# EAGLE schematic midiphile (EAGLE 7.6.0)
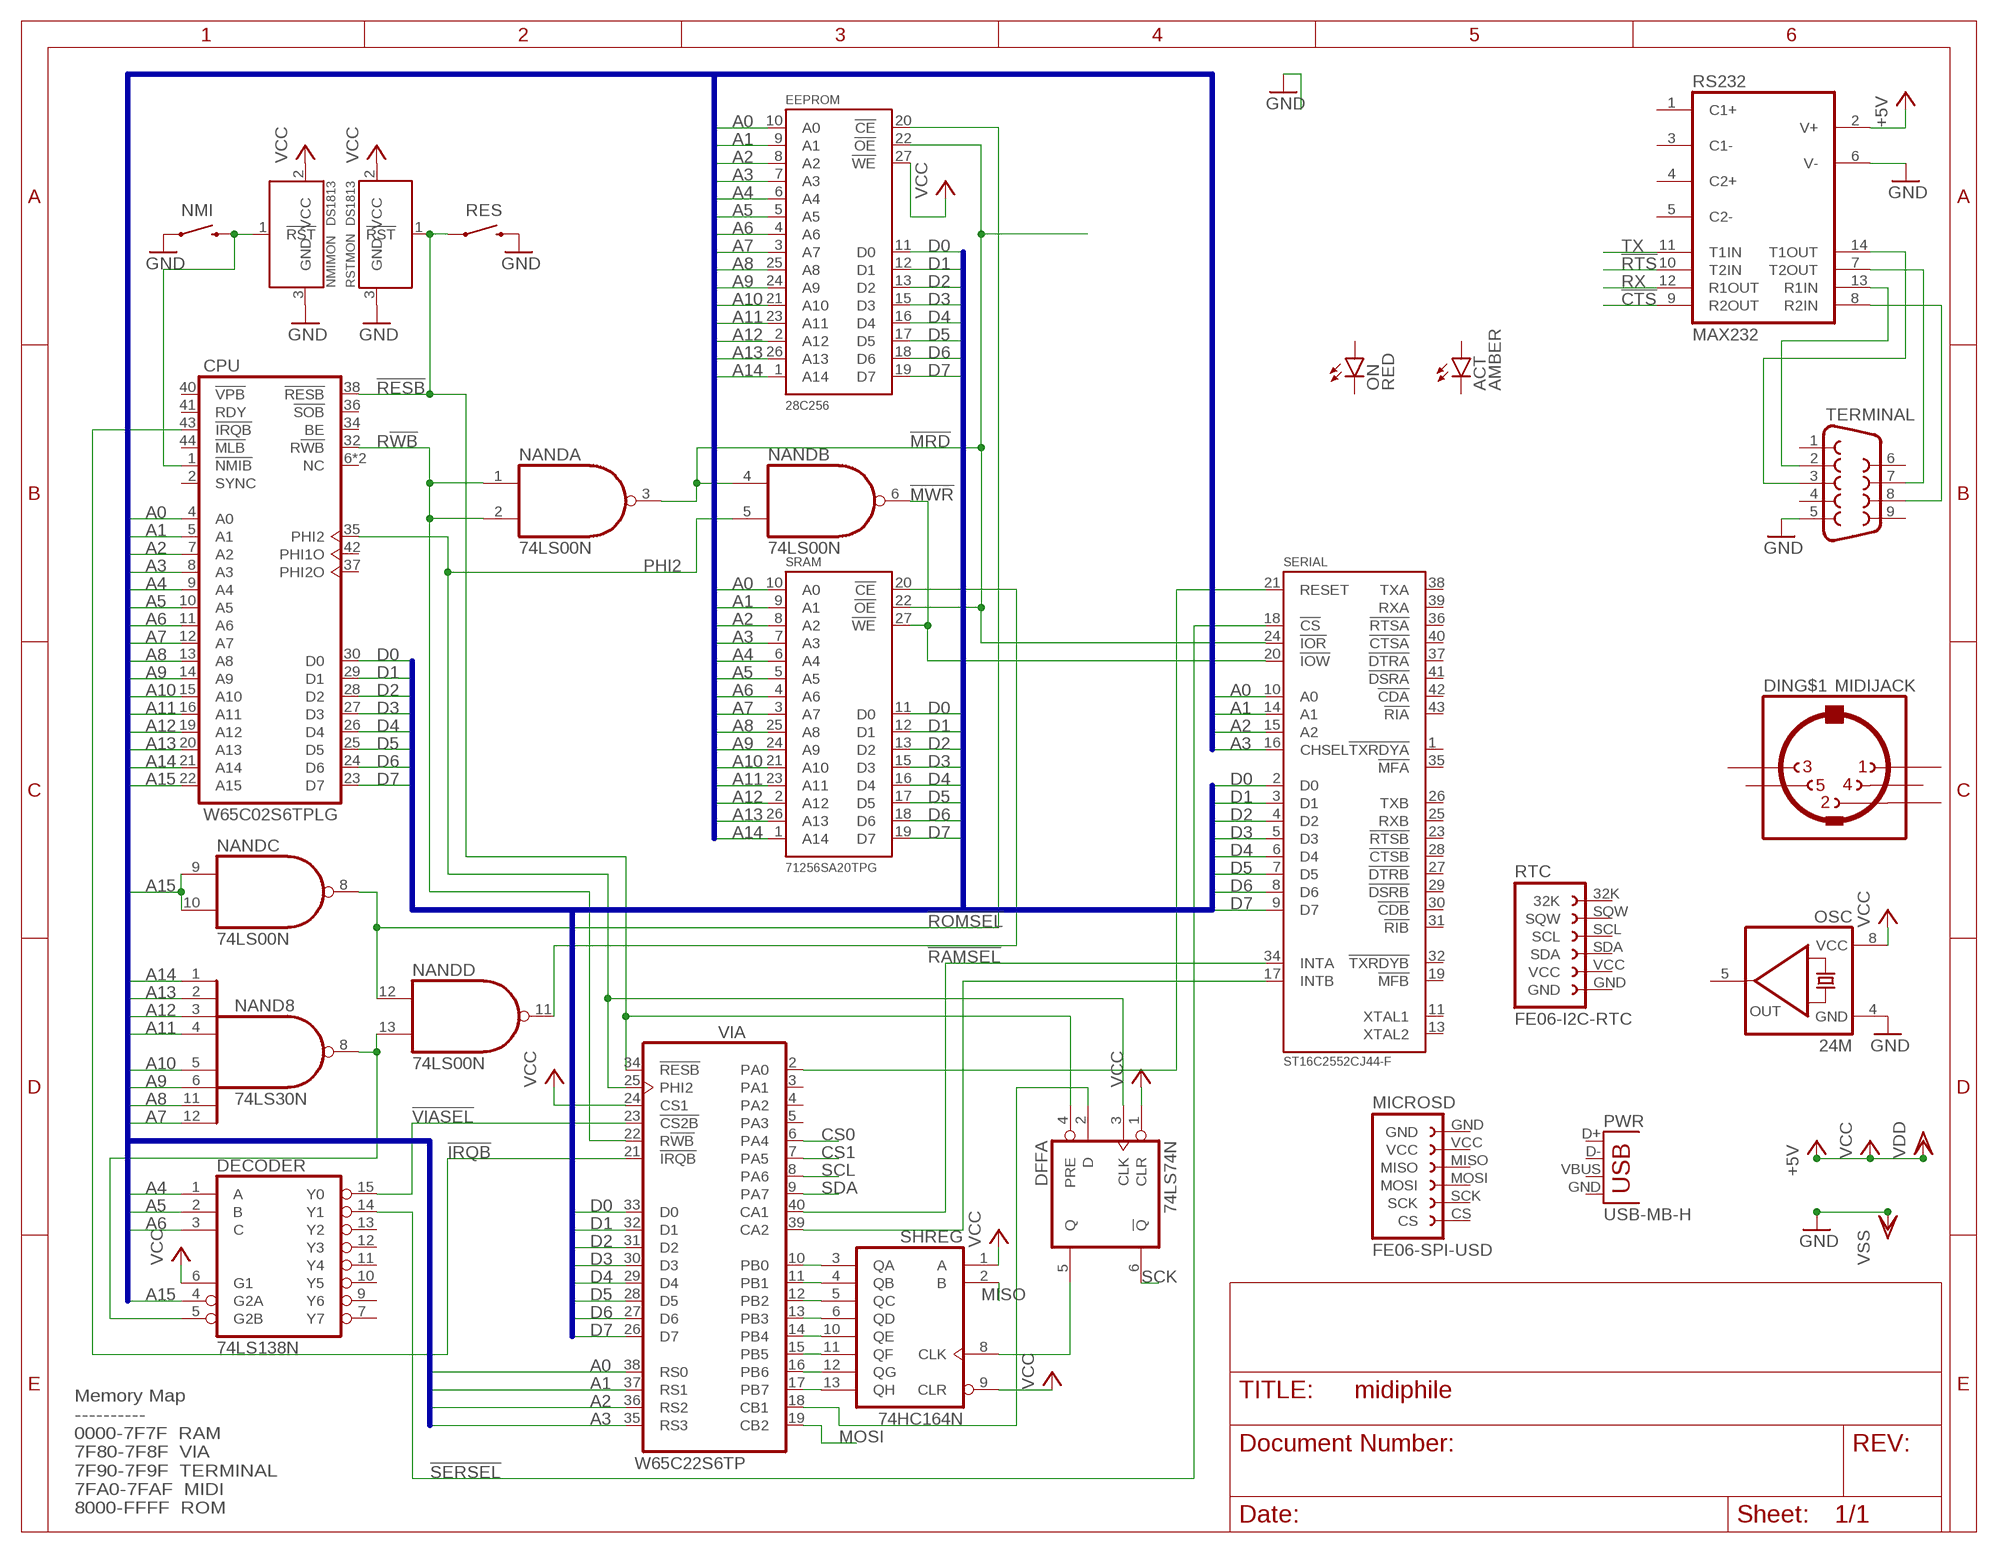
[diagram p0: schematic, sheet 1]

## Parts
ACT  AMBER  LED_RECT_2X5MM  [LED_RECT_2X5MM]
CPU  W65C02S6TPLG  [S44]
DECODER  74LS138N  [DIL16]
DFF  74LS74N  [DIL14]
DIN  MIDIJACK  [CP-2350]
EEPROM  28C256  [DIL28]
MICROSD  FE06-SPI-USD  [FE06-SPI-USD]
NAND  74LS00N  [DIL14]
NAND8  74LS30N  [DIL14]
NMI  SWITCH-MOMENTARY-2PTH  [TACTILE-PTH]
NMIMON  DS1813  [TO-92]
ON  RED  LED_RECT_2X5MM  [LED_RECT_2X5MM]
OSC  24M  HALF_CAN_OSC  [HALF_CAN_SOCKET]
PWR  USB-MB-H  [USB-MB-H]
RES  SWITCH-MOMENTARY-2PTH  [TACTILE-PTH]
RS232  MAX232  [DIL16]
RSTMON  DS1813  [TO-92]
RTC  FE06-I2C-RTC  [FE06-I2C-RTC]
SERIAL  ST16C2552CJ44-F  [S44]
SHREG  74HC164N  [DIL14]
SRAM  71256SA20TPG  [DIL28-3]
TERMINAL  DB9MALE  [DB9_MALE]
VIA  W65C22S6TP  [DIL40]

## Nets
!CTS!: RS232.9(R2OUT)
!IRQB!: CPU.43(!IRQB) VIA.21(VIA:!IRQB)
!MRD!: EEPROM.22(!OE!) NAND.3(A:O) NAND.4(B:I0) SERIAL.24(!IOR!) SRAM.22(!OE!)
!MWR!: NAND.6(B:O) SERIAL.20(!IOW!) SRAM.27(!WE!)
!RAMSEL!: NAND.11(D:O) SRAM.20(!CE!)
!RESB!: CPU.38(!RESB) DFF.4(A:PRE) RES.1 RSTMON.1(!RST!) VIA.34(VIA:!RESB)
!ROMSEL!: EEPROM.20(!CE!) NAND.8(C:O) NAND.12(D:I0)
!RTS!: RS232.10(T2IN)
!SERSEL!: DECODER.14(Y1) SERIAL.18(!CS!)
!VIASEL!: DECODER.15(Y0) VIA.23(VIA:!CS2B)
+5V: RS232.2(V+) ; supply symbol labelled VCC, VDD
A0: CPU.4(A0) EEPROM.10(A0) SERIAL.10(A0) SRAM.10(A0) VIA.38(VIA:RS0)
A1: CPU.5(A1) EEPROM.9(A1) SERIAL.14(A1) SRAM.9(A1) VIA.37(VIA:RS1)
A2: CPU.7(A2) EEPROM.8(A2) SERIAL.15(A2) SRAM.8(A2) VIA.36(VIA:RS2)
A3: CPU.8(A3) EEPROM.7(A3) SERIAL.16(CHSEL) SRAM.7(A3) VIA.35(VIA:RS3)
A4: CPU.9(A4) DECODER.1(A) EEPROM.6(A4) SRAM.6(A4)
A5: CPU.10(A5) DECODER.2(B) EEPROM.5(A5) SRAM.5(A5)
A6: CPU.11(A6) DECODER.3(C) EEPROM.4(A6) SRAM.4(A6)
A7: CPU.12(A7) EEPROM.3(A7) NAND8.12(I7) SRAM.3(A7)
A8: CPU.13(A8) EEPROM.25(A8) NAND8.11(I6) SRAM.25(A8)
A9: CPU.14(A9) EEPROM.24(A9) NAND8.6(I5) SRAM.24(A9)
A10: CPU.15(A10) EEPROM.21(A10) NAND8.5(I4) SRAM.21(A10)
A11: CPU.16(A11) EEPROM.23(A11) NAND8.4(I3) SRAM.23(A11)
A12: CPU.19(A12) EEPROM.2(A12) NAND8.3(I2) SRAM.2(A12)
A13: CPU.20(A13) EEPROM.26(A13) NAND8.2(I1) SRAM.26(A13)
A14: CPU.21(A14) EEPROM.1(A14) NAND8.1(I0) SRAM.1(A14)
A15: CPU.22(A15) DECODER.4(G2A) NAND.9(C:I0) NAND.10(C:I1)
CS0: VIA.6(VIA:PA4)
CS1: VIA.7(VIA:PA5)
D0: CPU.30(D0) EEPROM.11(D0) SERIAL.2(D0) SRAM.11(D0) VIA.33(VIA:D0)
D1: CPU.29(D1) EEPROM.12(D1) SERIAL.3(D1) SRAM.12(D1) VIA.32(VIA:D1)
D2: CPU.28(D2) EEPROM.13(D2) SERIAL.4(D2) SRAM.13(D2) VIA.31(VIA:D2)
D3: CPU.27(D3) EEPROM.15(D3) SERIAL.5(D3) SRAM.15(D3) VIA.30(VIA:D3)
D4: CPU.26(D4) EEPROM.16(D4) SERIAL.6(D4) SRAM.16(D4) VIA.29(VIA:D4)
D5: CPU.25(D5) EEPROM.17(D5) SERIAL.7(D5) SRAM.17(D5) VIA.28(VIA:D5)
D6: CPU.24(D6) EEPROM.18(D6) SERIAL.8(D6) SRAM.18(D6) VIA.27(VIA:D6)
D7: CPU.23(D7) EEPROM.19(D7) SERIAL.9(D7) SRAM.19(D7) VIA.26(VIA:D7)
GND: NMI.1 NMIMON.3(GND) OSC.4(GND) RES.3 RS232.6(V-) RSTMON.3(GND) TERMINAL.5 ; supply symbol labelled VSS
MISO: SHREG.2(B)
MOSI: VIA.19(VIA:CB2)
N$1: CPU.1(!NMIB) NMI.3 NMIMON.1(!RST!)
N$2: DECODER.5(G2B) NAND8.8(O) NAND.13(D:I1)
N$3: SERIAL.17(INTB) VIA.39(VIA:CA2)
N$4: SERIAL.34(INTA) VIA.40(VIA:CA1)
N$5: SERIAL.21(RESET) VIA.2(VIA:PA0)
N$7: SHREG.3(QA) VIA.10(VIA:PB0)
N$8: SHREG.4(QB) VIA.11(VIA:PB1)
N$9: SHREG.5(QC) VIA.12(VIA:PB2)
N$10: SHREG.6(QD) VIA.13(VIA:PB3)
N$11: SHREG.10(QE) VIA.14(VIA:PB4)
N$12: SHREG.11(QF) VIA.15(VIA:PB5)
N$13: SHREG.12(QG) VIA.16(VIA:PB6)
N$14: SHREG.13(QH) VIA.17(VIA:PB7)
N$15: DFF.2(A:D) VIA.18(VIA:CB1)
N$17: DFF.5(A:Q) SHREG.8(CLK)
N$21: RS232.14(T1OUT) TERMINAL.3
N$22: RS232.13(R1IN) TERMINAL.2
N$23: RS232.7(T2OUT) TERMINAL.7
N$24: RS232.8(R2IN) TERMINAL.8
PHI2: CPU.35(PHI2) DFF.3(A:CLK) NAND.5(B:I1) VIA.25(VIA:PHI2)
R!WB!: CPU.32(R!WB) NAND.1(A:I0) NAND.2(A:I1) VIA.22(VIA:R!WB)
RX: RS232.12(R1OUT)
SCK: DFF.6(A:!Q)
SCL: VIA.8(VIA:PA6)
SDA: VIA.9(VIA:PA7)
TX: RS232.11(T1IN)
VCC: DECODER.6(G1) DFF.1(A:CLR) EEPROM.27(!WE!) NMIMON.2(VCC) OSC.8(VCC) RSTMON.2(VCC) SHREG.1(A) SHREG.9(CLR) VIA.24(VIA:CS1)
Unconnected: ACT.+(A) ACT.-(C) CPU.2(SYNC) CPU.6(NC) CPU.33(NC) CPU.34(BE) CPU.36(!SOB) CPU.37(PHI2O) CPU.40(!VPB) CPU.41(RDY) CPU.42(PHI1O) CPU.44(!MLB) DECODER.7(Y7) DECODER.9(Y6) DECODER.10(Y5) DECODER.11(Y4) DECODER.12(Y3) DECODER.13(Y2) DFF.8(B:!Q) DFF.9(B:Q) DFF.10(B:PRE) DFF.11(B:CLK) DFF.12(B:D) DFF.13(B:CLR) DIN.1 DIN.2 DIN.3 DIN.4 DIN.5 DIN.PE1(MT) DIN.PE2(MT) DIN.PE(MT) DIN.PE@(MT) MICROSD.CS MICROSD.GND MICROSD.MISO MICROSD.MOSI MICROSD.SCK MICROSD.VCC ON.+(A) ON.-(C) OSC.5(OUT) PWR.D+ PWR.D- PWR.GND PWR.VBUS RS232.1(C1+) RS232.3(C1-) RS232.4(C2+) RS232.5(C2-) RTC.32K RTC.GND RTC.SCL RTC.SDA RTC.SQW RTC.VCC SERIAL.1(!TXRDYA!) SERIAL.11(XTAL1) SERIAL.13(XTAL2) SERIAL.19(!MFB!) SERIAL.23(!RTSB!) SERIAL.25(RXB) SERIAL.26(TXB) SERIAL.27(!DTRB!) SERIAL.28(!CTSB!) SERIAL.29(!DSRB!) SERIAL.30(!CDB!) SERIAL.31(!RIB!) SERIAL.32(!TXRDYB!) SERIAL.35(!MFA!) SERIAL.36(!RTSA!) SERIAL.37(!DTRA!) SERIAL.38(TXA) SERIAL.39(RXA) SERIAL.40(!CTSA!) SERIAL.41(!DSRA!) SERIAL.42(!CDA!) SERIAL.43(!RIA!) TERMINAL.1 TERMINAL.4 TERMINAL.6 TERMINAL.9 VIA.3(VIA:PA1) VIA.4(VIA:PA2) VIA.5(VIA:PA3)

## Buses
A[0..15]
D[0..7]

## Notes on the sheet
- Memory Map
  ----------
  0000-7F7F  RAM
  7F80-7F8F  VIA
  7F90-7F9F  TERMINAL
  7FA0-7FAF  MIDI
  8000-FFFF  ROM

## Power pins joined to a net without a drawn wire
+5V: CPU.3(VDD) CPU.31(VDD) DECODER.16(VCC) NAND.14(P:VCC) SERIAL.33(VDD) SERIAL.44(VDD) SHREG.14(VCC) SRAM.28(VDD)
GND: CPU.17(VSS) CPU.18(VSS) CPU.39(VSS) DECODER.8(GND) DFF.7(P:GND) NAND8.7(GND) NAND.7(P:GND) RS232.15(GND) SERIAL.12(VSS) SERIAL.22(VSS) SHREG.7(GND) SRAM.14(VSS)
VCC: DFF.14(P:VCC) NAND8.14(VCC) RS232.16(VCC)
VDD: EEPROM.28(VDD) VIA.20(VIAP:VDD)
VSS: EEPROM.14(VSS) VIA.1(VIAP:VSS)

## Library data of the parts
ACT ON = led:LED_RECT_2X5MM
CPU = 6502:W65C02S6TPLG
DECODER = 74xx-us:74*138: 3-line to 8-line DECODER/DEMULTIPLEXER
DFF = 74xx-us:74*74: Dual D type positive edge triggered FLIP FLOP, preset and clear
DIN = adafruit:MIDIJACK: DIN 5 jack also known as MIDI jack A modification of conn-hirshman:MAB5SH with two options for the grounding 'teeth'
EEPROM = 28Cxxx_eeprom:28C256
MICROSD = expansion_headers:FE06-SPI-USD
NAND = 74xx-us:74*00: Quad 2-input NAND gate
NAND8 = 74xx-us:74*30: 8-input NAND gate
NMI RES = SparkFun-Electromechanical:SWITCH-MOMENTARY-2: Various NO switches- pushbuttons, reed, etc; PROD_ID: SWCH-08441
NMIMON RSTMON = ds1813:DS1813
OSC = metal_can_oscillator:HALF_CAN_OSC
PWR = SparkFun-Connectors:USB: USB Connectors USB-B-PTH is fully proven SKU : PRT-00139/CONN-08278 USB-miniB is fully proven SKU : PRT-00587 USB-A-PCB is untested. USB-A-H is throughly reviewed, but untested. Spark Fun Electronics SKU : PRT-00437 USB-B-SMT is throughly reviewed, but untested. Needs silkscreen touching up. USB-A-S has not been used/tested USB-MB-H has not been used/tested USB-MICROB has been used. CONN-09505
RS232 = maxim:MAX232: RS232 TRANSCEIVER; MF: MAXIM; MPN: MAX232ACPE+; OC_FARNELL: 9723773; OC_NEWARK: 68K4544
RTC = expansion_headers:FE06-I2C-RTC
SERIAL = 16550:ST16C2552CJ44-F
SHREG = 74xx-us:74*164: 8-bit parallel out SHIFT REGISTER
SRAM = 71xxx_sram:71256SA20TPG
TERMINAL = SparkFun-Connectors:DB9: DB9 Connector Standard DB9 (D-Sub 9) serial connector. Can be used for CAN bus as well as RS485 and RS232. Footprint production proven. Spark Fun Electronics SKU : PRT-00429; PROD_ID: CONN-09904
VIA = 6502:W65C22S: W65C22 by WDC